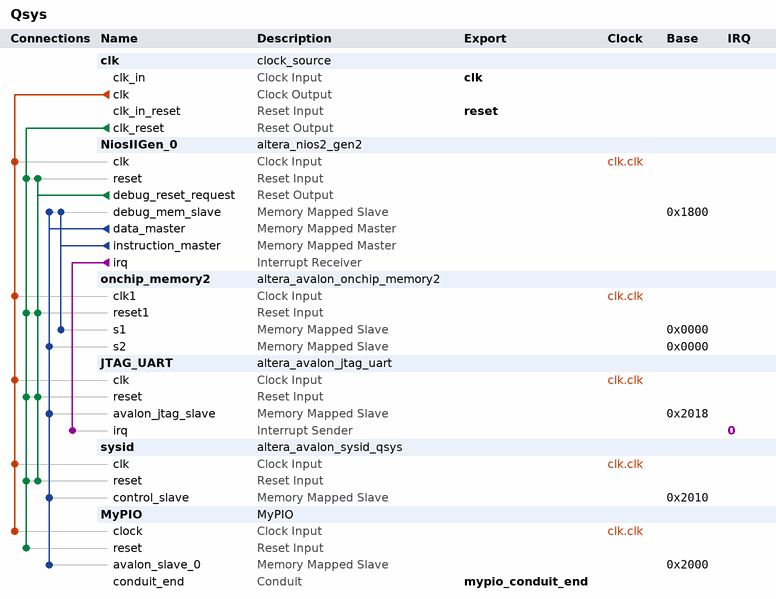
[diagram p0: system contents]
# Platform Designer (Qsys) system Qsys, Cyclone V 5CSEMA5F31C6
# Parameters at their usual value, and those the tool derives, are not listed.
package require -exact qsys 14.1
create_system Qsys
set_project_property DEVICE_FAMILY {Cyclone V}
set_project_property DEVICE 5CSEMA5F31C6

add_instance clk clock_source 14.1
set_instance_parameter_value clk clockFrequency 50000000

add_instance NiosIIGen_0 altera_nios2_gen2 14.1
set_instance_parameter_value NiosIIGen_0 dcache_size 2048
set_instance_parameter_value NiosIIGen_0 exceptionSlave onchip_memory2.s1
set_instance_parameter_value NiosIIGen_0 icache_size 4096
set_instance_parameter_value NiosIIGen_0 impl Fast
set_instance_parameter_value NiosIIGen_0 resetSlave onchip_memory2.s1

add_instance onchip_memory2 altera_avalon_onchip_memory2 14.1
set_instance_parameter_value onchip_memory2 dataWidth 32
set_instance_parameter_value onchip_memory2 dualPort true
set_instance_parameter_value onchip_memory2 initMemContent true
set_instance_parameter_value onchip_memory2 initializationFileName onchip_mem.hex
set_instance_parameter_value onchip_memory2 memorySize 4096
set_instance_parameter_value onchip_memory2 singleClockOperation true

add_instance JTAG_UART altera_avalon_jtag_uart 14.1
set_instance_parameter_value JTAG_UART simInteractiveOptions NO_INTERACTIVE_WINDOWS

add_instance sysid altera_avalon_sysid_qsys 14.1
set_instance_parameter_value sysid id 4659

add_instance MyPIO MyPIO 1.0

# connections
add_connection clk.clk JTAG_UART.clk clock
add_connection clk.clk MyPIO.clock clock
add_connection clk.clk NiosIIGen_0.clk clock
add_connection clk.clk onchip_memory2.clk1 clock
add_connection clk.clk sysid.clk clock
add_connection clk.clk_reset JTAG_UART.reset reset
add_connection clk.clk_reset MyPIO.reset reset
add_connection clk.clk_reset NiosIIGen_0.reset reset
add_connection clk.clk_reset onchip_memory2.reset1 reset
add_connection clk.clk_reset sysid.reset reset
add_connection NiosIIGen_0.debug_reset_request JTAG_UART.reset reset
add_connection NiosIIGen_0.debug_reset_request NiosIIGen_0.reset reset
add_connection NiosIIGen_0.debug_reset_request onchip_memory2.reset1 reset
add_connection NiosIIGen_0.debug_reset_request sysid.reset reset
add_connection NiosIIGen_0.data_master JTAG_UART.avalon_jtag_slave avalon
set_connection_parameter_value NiosIIGen_0.data_master/JTAG_UART.avalon_jtag_slave baseAddress 0x2018
add_connection NiosIIGen_0.data_master MyPIO.avalon_slave_0 avalon
set_connection_parameter_value NiosIIGen_0.data_master/MyPIO.avalon_slave_0 baseAddress 0x2000
add_connection NiosIIGen_0.data_master NiosIIGen_0.debug_mem_slave avalon
set_connection_parameter_value NiosIIGen_0.data_master/NiosIIGen_0.debug_mem_slave baseAddress 0x1800
add_connection NiosIIGen_0.data_master onchip_memory2.s2 avalon
set_connection_parameter_value NiosIIGen_0.data_master/onchip_memory2.s2 baseAddress 0x0000
add_connection NiosIIGen_0.data_master sysid.control_slave avalon
set_connection_parameter_value NiosIIGen_0.data_master/sysid.control_slave baseAddress 0x2010
add_connection NiosIIGen_0.instruction_master NiosIIGen_0.debug_mem_slave avalon
set_connection_parameter_value NiosIIGen_0.instruction_master/NiosIIGen_0.debug_mem_slave baseAddress 0x1800
add_connection NiosIIGen_0.instruction_master onchip_memory2.s1 avalon
set_connection_parameter_value NiosIIGen_0.instruction_master/onchip_memory2.s1 baseAddress 0x0000
add_connection NiosIIGen_0.irq JTAG_UART.irq interrupt
set_connection_parameter_value NiosIIGen_0.irq/JTAG_UART.irq irqNumber 0

# exported interfaces
add_interface clk clock sink
set_interface_property clk EXPORT_OF clk.clk_in
add_interface mypio_conduit_end conduit end
set_interface_property mypio_conduit_end EXPORT_OF MyPIO.conduit_end
add_interface reset reset sink
set_interface_property reset EXPORT_OF clk.clk_in_reset

set_interconnect_requirement {$system} qsys_mm.clockCrossingAdapter HANDSHAKE
set_interconnect_requirement {$system} qsys_mm.insertDefaultSlave FALSE
set_interconnect_requirement {$system} qsys_mm.maxAdditionalLatency 1

save_system Qsys.qsys
